# EAGLE design picaxe_funky (EAGLE 7.5.0)
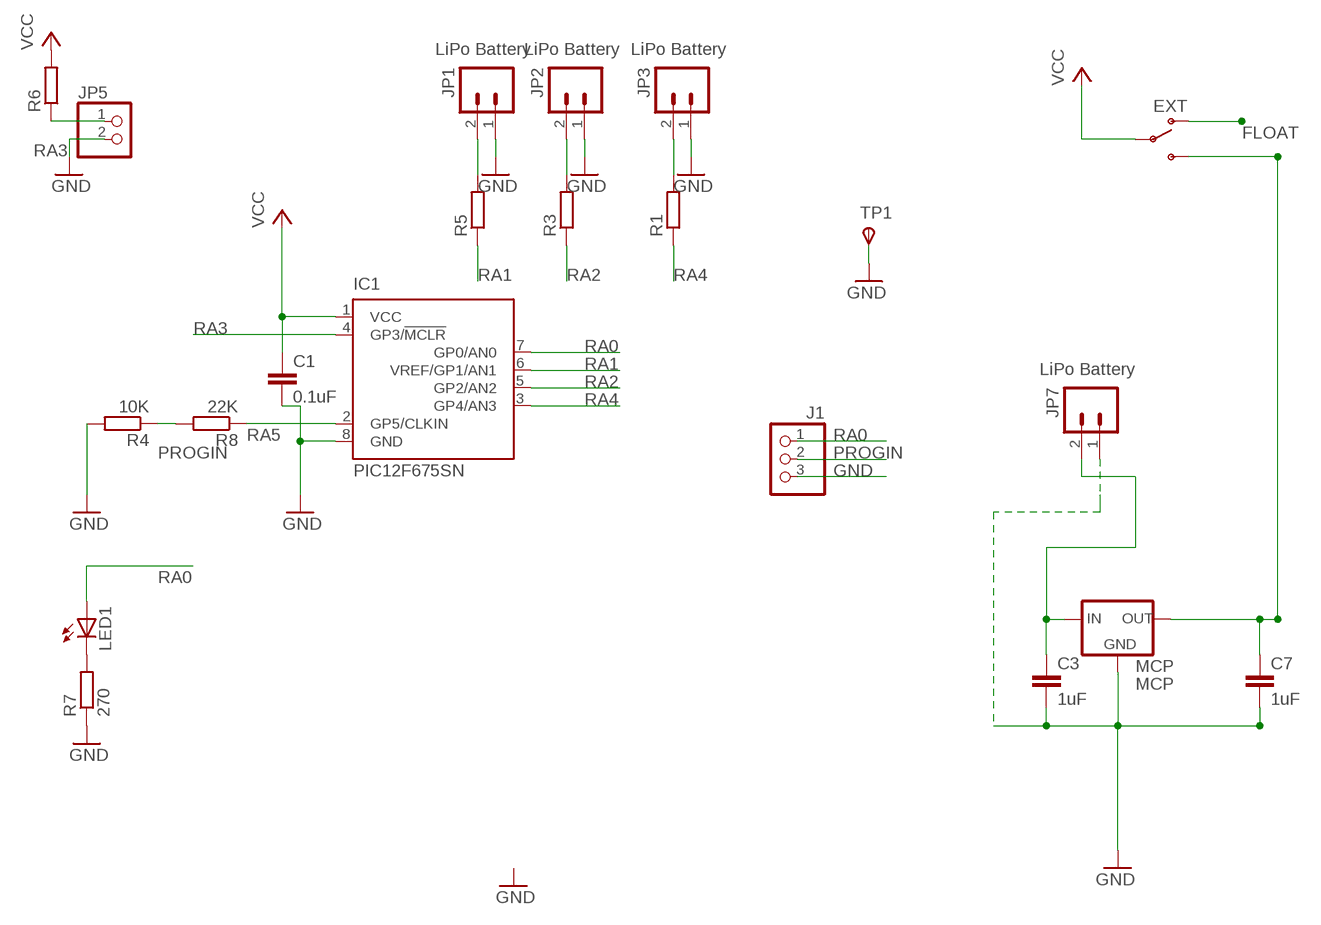
[diagram p0: schematic, sheet 1]

## Parts
C1  0.1uF  C-EUC0805  [C0805]
C3  1uF  C-EUC0805  [C0805]
C7  1uF  C-EUC0805  [C0805]
IC1  PIC12F675SN  [SO-08]
J1  PINHD-1X3  [1X03]
JP1  LiPo Battery  M02JST-PTH-2  [JST-2-PTH]
JP2  LiPo Battery  M02JST-PTH-2  [JST-2-PTH]
JP3  LiPo Battery  M02JST-PTH-2  [JST-2-PTH]
JP5  PINHD-1X2  [1X02]
JP7  LiPo Battery  M02JST-PTH-2  [JST-2-PTH]
LED1  LEDCHIPLED_1206  [CHIPLED_1206]
MCP  MCP  MCP1700SOT-23  [SOT-23]
ON  EXT  SWITCH-SPSTPTH  [SWITCH-SPDT]
R1  R-EU_R0805  [R0805]
R3  R-EU_R0805  [R0805]
R4  10K  R-EU_R0805  [R0805]
R5  R-EU_R0805  [R0805]
R6  R-EU_R0805  [R0805]
R7  270  R-EU_R0805  [R0805]
R8  22K  R-EU_R0805  [R0805]
TP1  TPSTP20R  [TP20R]

## Nets
FLOAT: ON.1(O)
GND [GND]: C1.2 C3.2 C7.2 IC1.8(GND) J1.3 JP1.1 JP2.1 JP3.1 JP5.2 JP7.1 MCP.1(GND) R4.2 R7.1 TP1.TP(PP)
N$1: JP1.2 R5.2
N$2: JP2.2 R3.2
N$3: JP3.2 R1.2
N$4: LED1.C R7.2
PROGIN: J1.2 R4.1 R8.2
RA0: IC1.7(GP0/AN0) J1.1 LED1.A
RA1: IC1.6(VREF/GP1/AN1) R5.1
RA2: IC1.5(GP2/AN2) R3.1
RA3: IC1.4(GP3/!MCLR) JP5.1 R6.1
RA4: IC1.3(GP4/AN3) R1.1
RA5: IC1.2(GP5/CLKIN) R8.1
VCC [VCC]: C1.1 IC1.1(VCC) ON.2(P) R6.2
VCCEXT [VCC]: C3.1 JP7.2 MCP.3(IN)
VCCREG [VCC]: C7.1 MCP.2(OUT) ON.3(S)

## Library data of the parts
C1 C3 C7 = resistor:C-EU: CAPACITOR, European symbol
IC1 = microchip:PIC12F675: 8-Pin FLASH-Based 8-Bit CMOS Microcontroller Precision Internal 4 MHz oscillator factory calibrated to ±1% Low Power Features: Standby Current: - 1 nA @ 2.0V, typical Operating Current: - 8.5µA @ 32 kHz, 2.0V, typical - 100µA @ 1 MHz, 2.0V, typical Watchdog Timer Current: - 300 nA @ 2.0V, typical Timer1 oscillator current: - 4µA @ 32 kHz, 2.0V, typical Analog-to-Digital Converter module: - 10-bit resolution - Programmable 4-channel input - Voltage reference input Source: http://www.microchip.com .. 41190E.pdf; MF: MICROCHIP; MPN: PIC12F675-E/SN; OC_FARNELL: 9759026; OC_NEWARK: 92C4341
J1 = pinhead:PINHD-1X3: PIN HEADER
JP1-JP3 JP7 = SparkFun:M02: Header 2 Standard 2-pin 0.1" header. Use with straight break away headers (SKU : PRT-00116), right angle break away headers (PRT-00553), swiss pins (PRT-00743), machine pins (PRT-00117), and female headers (PRT-00115). Molex polarized connector foot print use with SKU : PRT-08233 with associated crimp pins and housings.
JP5 = pinhead:PINHD-1X2: PIN HEADER
LED1 = led:LED: LED OSRAM: - CHIPLED LG R971, LG N971, LY N971, LG Q971, LY Q971, LO R971, LY R971 LH N974, LH R974 LS Q976, LO Q976, LY Q976 LO Q996 - Hyper CHIPLED LW Q18S LB Q993, LB Q99A, LB R99A - SideLED LS A670, LO A670, LY A670, LG A670, LP A670 LB A673, LV A673, LT A673, LW A673 LH A674 LY A675 LS A676, LA A676, LO A676, LY A676, LW A676 LS A679, LY A679, LG A679 - Hyper Micro SIDELED® LS Y876, LA Y876, LO Y876, LY Y876 LT Y87S - SmartLED LW L88C, LW L88S LB L89C, LB L89S, LG L890 LS L89K, LO L89K, LY L89K LS L896, LA L896, LO L896, LY L896 - TOPLED LS T670, LO T670, LY T670, LG T670, LP T670 LSG T670, LSP T670, LSY T670, LOP T670, LYG T670 LG T671, LOG T671, LSG T671 LB T673, LV T673, LT T673, LW T673 LH T674 LS T676, LA T676, LO T676, LY T676, LB T676, LH T676, LSB T676, LW T676 LB T67C, LV T67C, LT T67C, LS T67K, LO T67K, LY T67K, LW E67C LS E67B, LA E67B, LO E67B, LY E67B, LB E67C, LV E67C, LT E67C LW T67C LS T679, LY T679, LG T679 LS T770, LO T770, LY T770, LG T770, LP T770 LB T773, LV T773, LT T773, LW T773 LH T774 LS E675, LA E675, LY E675, LS T675 LS T776, LA T776, LO T776, LY T776, LB T776 LHGB T686 LT T68C, LB T68C - Hyper Mini TOPLED® LB M676 - Mini TOPLED Santana® LG M470 LS M47K, LO M47K, LY M47K Source: http://www.osram.convergy.de LUXEON: - LUMILED® LXK2-PW12-R00, LXK2-PW12-S00, LXK2-PW14-U00, LXK2-PW14-V00 LXK2-PM12-R00, LXK2-PM12-S00, LXK2-PM14-U00 LXK2-PE12-Q00, LXK2-PE12-R00, LXK2-PE12-S00, LXK2-PE14-T00, LXK2-PE14-U00 LXK2-PB12-K00, LXK2-PB12-L00, LXK2-PB12-M00, LXK2-PB14-N00, LXK2-PB14-P00, LXK2-PB14-Q00 LXK2-PR12-L00, LXK2-PR12-M00, LXK2-PR14-Q00, LXK2-PR14-R00 LXK2-PD12-Q00, LXK2-PD12-R00, LXK2-PD12-S00 LXK2-PH12-R00, LXK2-PH12-S00 LXK2-PL12-P00, LXK2-PL12-Q00, LXK2-PL12-R00 Source: www.luxeon.com KINGBRIGHT: KA-3528ASYC Source: www.kingbright.com
MCP = MY_IC:MCP1700
ON = SparkFun:SWITCH-SPST: SPST Switch Simple slide switch. Spark Fun Electronics SKU : COM-00102
R1 R3-R8 = resistor:R-EU_: RESISTOR, European symbol
TP1 = testpad:TPS: TEST PIN

## Net classes
0 default: width 0.016 mm
1 GND: width 0.025 mm, drill 0.508 mm, clearance 0.254 mm
2 VCC: width 0.025 mm, drill 0.508 mm, clearance 0.254 mm

## Board
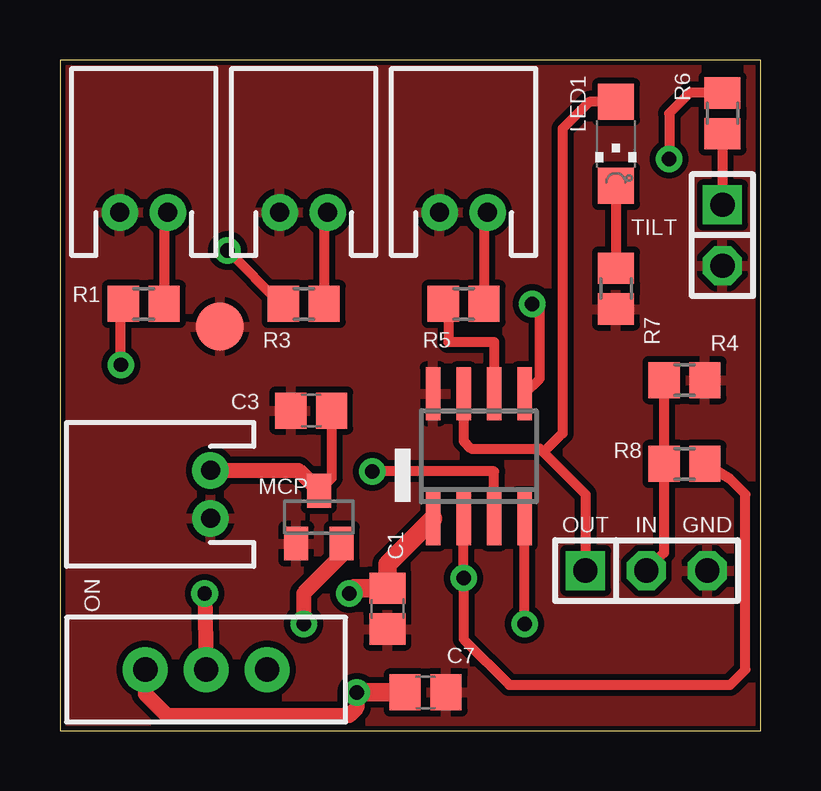
[diagram p1: board, top side]
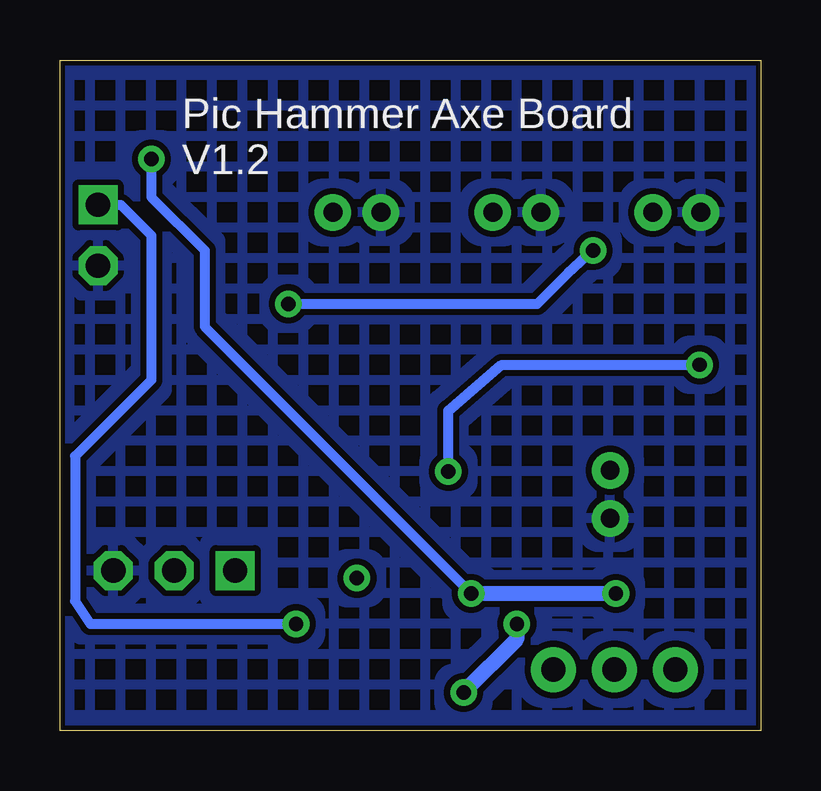
[diagram p2: board, bottom side, seen from below]

Size 29.21 x 27.94 mm. Coordinates in mm from the lower left corner, seen from the top.
Outline: 0,0 29.21,0 29.21,27.94 0,27.94 0,0
Copper layers (1*16): Top 0.035mm / dielectric 1.5mm / Bottom 0.035mm
Design rules "SparkFun *": minimum track width 20mil, minimum drill 20mil, track to track 8mil, track to pad 8mil, pad to pad 8mil, via to via 8mil, smd to smd 8mil, copper to edge 8mil, drill to drill 8mil, minimum pad ring 12mil, minimum via ring 10mil, stop-mask expansion 4mil, vias tented up to drill 25mil, thermal gap 10mil

### Footprints (pad centres in the part's own frame; a part is rotated, then mirrored left to right if it is on the bottom)
C0805 = smd 1.3 x 1.5: 1 -0.85,0; 2 0.85,0
SO-08 = smd 0.6 x 2.2: 1 -1.905,-2.6; 2 -0.635,-2.6; 3 0.635,-2.6; 4 1.905,-2.6; 5 1.905,2.6; 6 0.635,2.6; 7 -0.635,2.6; 8 -1.905,2.6
1X03 = drill 1.016 square: 1 -2.54,0 | drill 1.016 octagon: 2 0,0; 3 2.54,0
JST-2-PTH = drill 0.787 pad 1.524: 1 -1,0; 2 1,0
1X02 = drill 1.016 square: 1 -1.27,0 | drill 1.016 octagon: 2 1.27,0
CHIPLED_1206 = smd 1.5 x 1.5: A 0,-1.75; C 0,1.75
SOT-23 = smd 1 x 1.4: 1 -0.95,-1.1; 2 0.95,-1.1; 3 0,1.1
SWITCH-SPDT = drill 1.016 pad 1.88: 1 0,2.54; 2 0,0; 3 0,-2.54
R0805 = smd 1.3 x 1.5: 1 -0.85,0; 2 0.85,0
TP20R = smd 2 x 2: TP 0,0

### Placement (x,y rotation side)
C1  13.65,5.08 270 top
C3  10.48,13.34 180 top
C7  15.24,1.59 0 top
IC1  17.46,11.43 0 top
J1  24.45,6.67 0 top
JP1  16.83,21.59 0 top
JP2  10.16,21.59 0 top
JP3  3.49,21.59 0 top
JP5  27.62,20.64 270 top
JP7  6.27,9.84 90 top
LED1  23.18,24.45 180 top
MCP  10.79,8.89 0 top
ON  6.1,2.54 270 top
R1  3.49,17.78 0 top
R3  10.16,17.78 0 top
R4  26.04,14.61 0 top
R5  16.83,17.78 0 top
R6  27.62,25.72 90 top
R7  23.18,18.41 90 top
R8  26.04,11.11 180 top
TP1  6.67,16.83 0 top

### Tracks (layer width: path | path; a pad name or v marks a point on that pad's centre or on a via)
GND
  pour Top: -0.64,28.58 29.53,28.58 29.21,-0.64 -0.64,-0.64
  pour Bottom (hatched): -0.64,28.58 29.53,28.58 29.21,-0.64 -0.64,-0.64
N$1
  Top 0.406: JP1.2 17.68,21.44 R5.2
N$2
  Top 0.406: JP2.2 11.01,21.44 R3.2
N$3
  Top 0.406: JP3.2 4.34,21.44 R1.2
N$4
  Top 0.406: LED1.C R7.2
PROGIN
  Top 0.406: R4.1 R8.2 25.19,7.4 J1.2
RA0
  Top 0.406: IC1.7 16.83,12.07 17.14,11.75 20,11.75 20.16,11.59 | LED1.A 22.07,26.2 20.96,25.08 20.96,12.38 20.16,11.59 | 20.16,11.59 21.91,9.84 J1.1
RA1
  Top 0.406: R5.1 16.19,17.57 16.19,16.19 18.1,16.19 IC1.6
RA2  (via drill 0.6)
  Top 0.406: IC1.5 20,14.66 20,17.78 v19.69,17.78 | v6.98,20 9.21,17.78 R3.1
  Bottom 0.406: v19.69,17.78 R3.1 8.04,19.05 v6.98,20
RA3  (via drill 0.6)
  Top 0.406: R6.1 JP5.1 | v19.37,4.45 IC1.4
  Bottom 0.406: JP5.1 26.67,21.91 25.4,20.64 25.4,14.61 28.57,11.43 28.57,5.4 27.94,4.45 v19.37,4.45
RA4  (via drill 0.6)
  Top 0.406: IC1.3 18.1,10.79 v13.02,10.79 | v2.54,15.24 2.54,17.68 R1.1
  Bottom 0.406: v13.02,10.79 13.02,13.34 10.79,15.24 v2.54,15.24
RA5  (via drill 0.6)
  Top 0.406: IC1.2 v16.83,6.35 16.83,3.81 18.73,1.9 27.94,1.9 28.57,2.54 28.57,9.84 27.94,10.48 R8.1
VCC  (via drill 0.6)
  Top 0.406: R6.2 26.25,26.57 25.4,25.72 v25.4,23.81
  Top 0.635: v6.03,5.71 6.1,2.6 ON.2
  Top 0.762: IC1.1 13.65,6.92 C1.1 12.28,5.93 v12.06,5.71
  Bottom 0.406: v25.4,23.81 25.4,22.23 23.18,20 23.18,16.83 v12.06,5.71
  Bottom 0.635: v12.06,5.71 v6.03,5.71
VCCEXT
  Top 0.406: C3.1 11.33,10.52 MCP.3
  Top 0.635: JP7.2 9.94,10.84 MCP.3
VCCREG  (via drill 0.6)
  Top 0.635: MCP.2 11.74,7.3 10.16,5.71 v10.16,4.45 | ON.3 3.56,1.52 4.45,0.63 12.06,0.63 12.38,0.95 v12.38,1.59
  Top 0.762: C7.1 v12.38,1.59
  Bottom 0.635: v10.16,4.45 10.16,3.81 v12.38,1.59

### Text on the board
tNames: TILT | OUT | IN | GND
bNames: Pic Hammer Axe Board / V1.2